# Altium schematic sheet Sheet2.SchDoc
size A
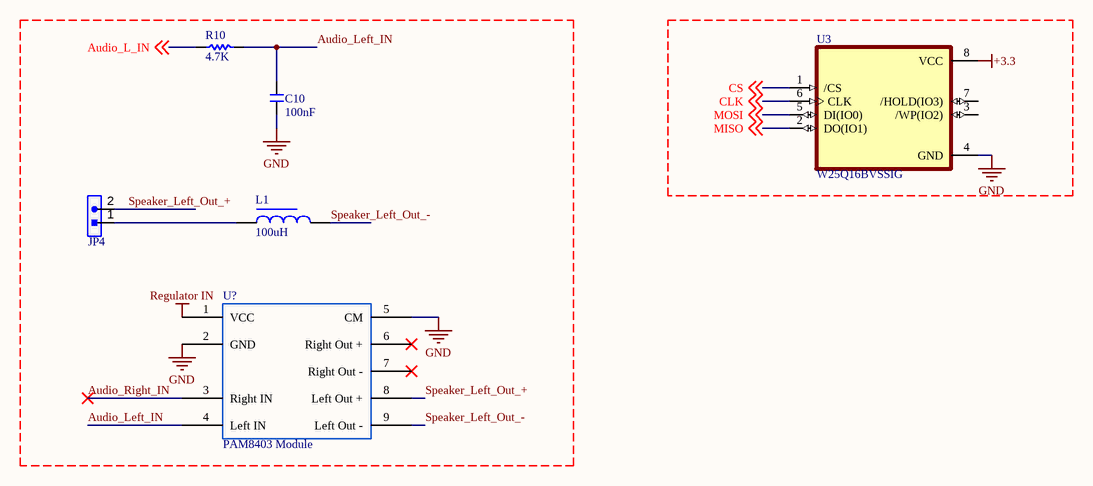
[diagram p0: Sheet2.SchDoc]

## Parts
C10  100nF  [C 0805]
JP4  HDR-1X2  [HDR-1X2]  (value not drawn)
L1  100uH  [L 0805]
R10  4.7K  [R 0805]
U3  W25Q16BVSSIG  [SOIC127P790X216-8N]
U?  PAM8403 Module  [PAM80403 Module]

## Nets
+3.3: U3.8(VCC)
GND: C10.1 U3.4(GND) U?.2(GND) U?.5(CM)
Regulator IN: U?.1(VCC)
Audio_L_IN: R10.1 ; off-sheet Audio_L_IN
Audio_Left_IN: C10.2 R10.2 U?.4(Left_IN)
Audio_Right_IN: U?.3(Right_IN)
CLK: U3.6(CLK) ; off-sheet CLK
CS: U3.1(/CS) ; off-sheet CS
MISO: U3.2(DO(IO1)) ; off-sheet MISO
MOSI: U3.5(DI(IO0)) ; off-sheet MOSI
Speaker_Left_Out_+: JP4.2 U?.8(Left_Out_+)
Speaker_Left_Out_-: L1.2 U?.9(Left_Out_-)
NetJP4_1: JP4.1 L1.1

Not connected (* = marked no-connect by the designer): U3 3(/WP(IO2)) 7(/HOLD(IO3)); U? 6(Right_Out_+)* 7(Right_Out_-)*

## Library data of the parts
C10 = C: Non-polar patch capacitor; BOM名称: 无极性贴片电容; 版权归属: 源创客; 学习资源: www.ooocke.com
JP4 = Header 2: 2P Connector; BOM名称: 2P接插件; 版权归属: 源创客; 学习资源: www.ooocke.com
L1 = L: Low power chip inductor; BOM名称: 小功率贴片电感; 版权归属: 源创客; 学习资源: www.ooocke.com
R10 = R: Chip resistor; 版权归属: 源创客; BOM名称: Chip resistor; 学习资源: www.ooocke.com
U3 = W25Q16BVSSIG: FLASH - NOR Memory IC 16Mb _2M x 8_ SPI 104MHz 8-SOIC; MF: Winbond; Availability: Unavailable; MP: W25Q16BVSSIG; SnapEDA_Link: https://www.snapeda.com/parts/W25Q16BVSSIG/Winbond%20Electronics/view-part/512685/?ref=snap; Value: *; Price: None; Package: SOIC-8 Winbond